# Altium schematic sheet Game Joystick rocker.SchDoc
size A4
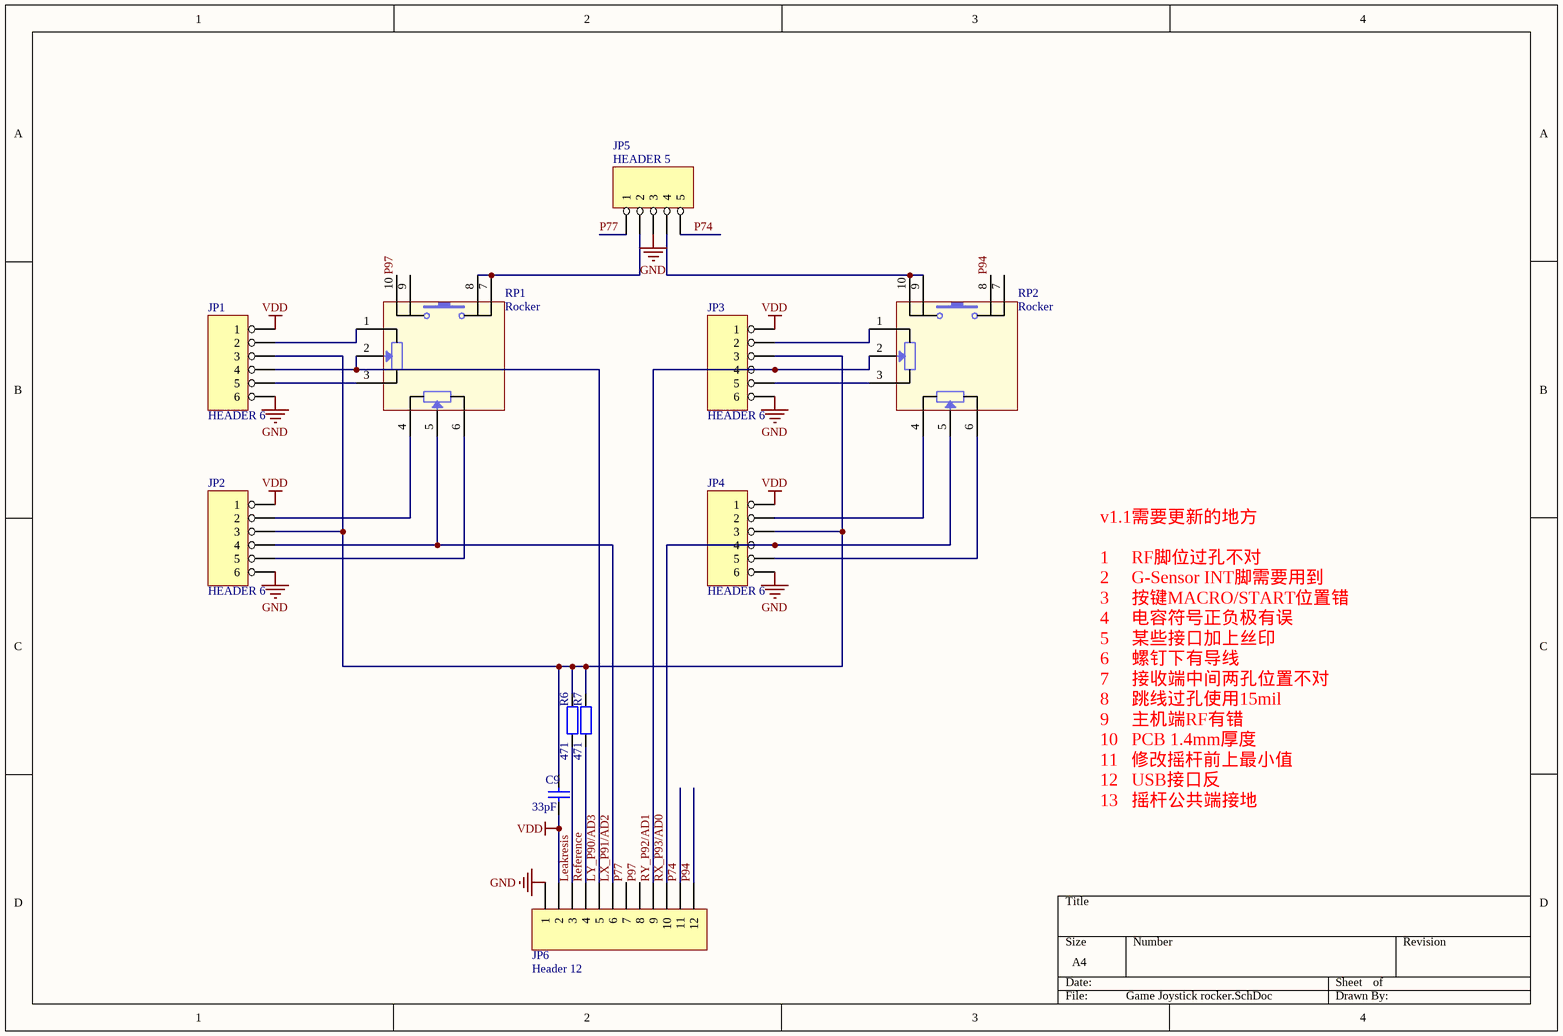
[diagram p0: Game Joystick rocker.SchDoc]

## Parts
C9  value 33pF  [CAPL]  (hidden comment: Cap)
JP1  HEADER 6  [SIP6]
JP2  HEADER 6  [SIP6]
JP3  HEADER 6  [SIP6]
JP4  HEADER 6  [SIP6]
JP5  HEADER 5  [SIP5]
JP6  Header 12  [SIP12]
R6  value 471  [AXIAL0.4]  (hidden comment: Res2)
R7  value 471  [AXIAL0.4]  (hidden comment: Res2)
RP1  Rocker  [Rocker]
RP2  Rocker  [Rocker]

## Nets
GND: JP1.6 JP2.6 JP3.6 JP4.6 JP5.3 JP6.1 RP1.11 RP1.12 RP1.13 RP1.14 RP2.11 RP2.12 RP2.13 RP2.14
VDD: C9.2 JP1.1 JP2.1 JP3.1 JP4.1 JP6.2
Leakresis: JP6.3 R6.1
LX_P91/AD2: JP2.4 JP6.6 RP1.5
LY_P90/AD3: JP1.4 JP6.5 RP1.2
P74: JP5.5 JP6.11
P77: JP5.1 JP6.7
P94: JP6.12 RP2.8
P97: JP6.8 RP1.10
Reference: JP6.4 R7.1
RX_P93/AD0: JP4.4 JP6.10 RP2.5
RY_P92/AD1: JP3.4 JP6.9 RP2.2
NetC9_1: C9.1 JP1.3 JP2.3 JP3.3 JP4.3 R6.2 R7.2
NetJP1_2: JP1.2 RP1.1
NetJP1_5: JP1.5 RP1.3
NetJP2_2: JP2.2 RP1.4
NetJP2_5: JP2.5 RP1.6
NetJP3_2: JP3.2 RP2.1
NetJP3_5: JP3.5 RP2.3
NetJP4_2: JP4.2 RP2.4
NetJP4_5: JP4.5 RP2.6
NetJP5_2: JP5.2 RP1.7 RP1.8
NetJP5_4: JP5.4 RP2.9 RP2.10

Not connected (* = marked no-connect by the designer): RP1 9; RP2 7

## Notes on the sheet
- v1.1需要更新的地方
  1     RF脚位过孔不对
  2     G-Sensor INT脚需要用到
  3     按键MACRO/START位置错
  4     电容符号正负极有误
  5     某些接口加上丝印
  6     螺钉下有导线
  7     接收端中间两孔位置不对
  8     跳线过孔使用15mil
  9     主机端RF有错
  10   PCB 1.4mm厚度
  11   修改摇杆前上最小值
  12   USB接口反
  13   摇杆公共端接地

## Library data of the parts
C9 = Cap: Capacitor; Published: 8-Jun-2000; LatestRevisionDate: 17-Jul-2002; LatestRevisionNote: Re-released for DXP Platform.; PackageReference: RAD-0.3; Publisher: Altium Limited
JP6 = Header 12: Header, 12-Pin; LatestRevisionDate: 17-Jul-2002; LatestRevisionNote: Re-released for DXP Platform.; Publisher: Altium Limited
R6 R7 = Res2: Resistor; Published: 8-Jun-2000; LatestRevisionDate: 17-Jul-2002; LatestRevisionNote: Re-released for DXP Platform.; PackageReference: AXIAL-0.4; Publisher: Altium Limited
RP1 RP2 = Rocker: jostick rocker